# EasyEDA schematic schematic_file_source.json
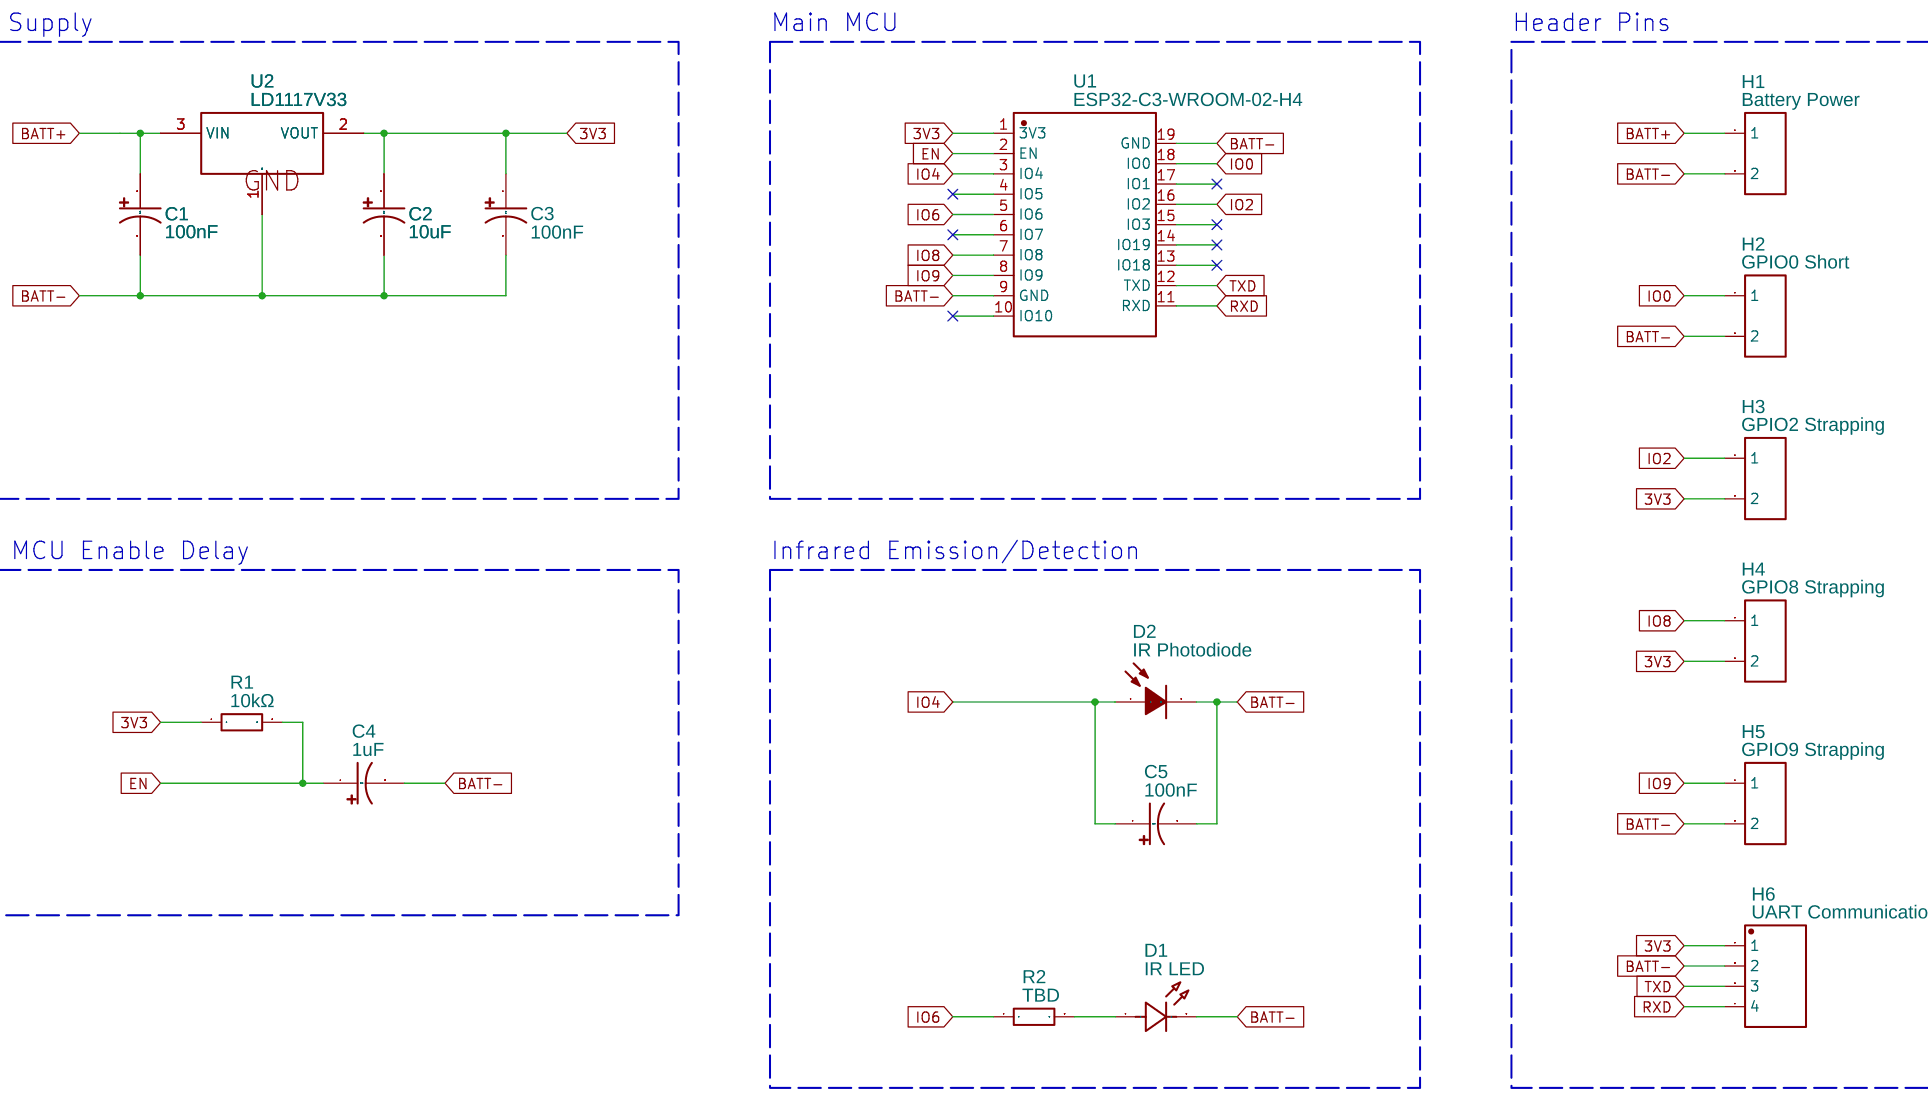
[diagram p0: schematic sheet]

## Parts
C1  100nF  [CAP-TH_BD6.3-P2.50-D1.0-FD]
C2  10uF  [CAP-TH_BD6.3-P2.50-D1.0-FD]
C3  100nF  [CAP-TH_BD6.3-P2.50-D1.0-FD]
C4  1uF  [CAP-TH_BD6.3-P2.50-D1.0-FD]
C5  100nF  [CAP-TH_BD6.3-P2.50-D1.0-FD]
D1  IR LED  [LED-TH_BD5.0-P2.54-FD]
D2  IR Photodiode  [LED-TH_BD6.2-P2.54-RD]
H1  Battery Power  [HDR-TH_2P-P2.54-V-M-1]
H2  GPIO0 Short  [HDR-TH_2P-P2.54-V-M-1]
H3  GPIO2 Strapping  [HDR-TH_2P-P2.54-V-M-1]
H4  GPIO8 Strapping  [HDR-TH_2P-P2.54-V-M-1]
H5  GPIO9 Strapping  [HDR-TH_2P-P2.54-V-M-1]
H6  UART Communication  [HDR-TH_4P-P2.54-V-M]
R1  10kΩ  [RES-TH_BD2.3-L6.5-P10.50-D0.5]
R2  TBD  [RES-TH_BD2.3-L6.5-P10.50-D0.5]
U1  ESP32-C3-WROOM-02-H4  [WIFIM-SMD_18P-L20.0-W18.0-P1.50]
U2  LD1117V33  [TO-220-3_L10.0-W4.5-P2.54-L]

## Library data of the parts
C1 C3-C5 = RK1052GMD122RB: Contributor: LCSC; Supplier: LCSC; Supplier Part: C399034; Manufacturer: Xunda(讯达); JLCPCB Part Class: Extended Part
C2 = RK1052GMD122RB: Contributor: LCSC; Supplier: LCSC; Supplier Part: C399034; Manufacturer: Xunda(讯达); JLCPCB Part Class: Extended Part; Package Display: No
D1 = 15400594F3590: Supplier: LCSC; Supplier Part: C5476599; Manufacturer: Wurth(伍尔特); Contributor: lcsc; JLCPCB Part Class: Extended Part
D2 = MHL590PD03BRT: Contributor: LCSC; Supplier: LCSC; Supplier Part: C405265; Manufacturer: MEIHUA(美华); JLCPCB Part Class: Extended Part
H1-H5 = Header-Male-2.54_1x2: Supplier: LCSC; Manufacturer: TE Connectivity(泰科电子); Manufacturer Part: 826629-2; Supplier Part: C86471; JLCPCB Part Class: Extended Part
H6 = Header-Male-2.54_1x4: Contributor: LCSC; Supplier: LCSC; Manufacturer: Ckmtw(灿科盟); Manufacturer Part: B-2100S04P-A110; Supplier Part: C124378; JLCPCB Part Class: Extended Part
R1 R2 = RI40-1/4W-10KΩ ±5% T: Contributor: LCSC; Supplier: LCSC; Supplier Part: C136549; Manufacturer: CCO(千志电子); JLCPCB Part Class: Extended Part
U1 = ESP32-C3-WROOM-02-H4: Contributor: LCSC; Supplier: LCSC; Supplier Part: C2944070; Manufacturer: ESPRESSIF(乐鑫); JLCPCB Part Class: Extended Part
U2 = LD1117V33: Contributor: LCSC; Supplier: LCSC; Supplier Part: C283467; Manufacturer: ST(意法半导体); JLCPCB Part Class: Extended Part

## Nets
3V3: C2.1 C3.1 H3.2 H4.2 H6.1 R1.1 U1.1(3V3) U2.2(VOUT)
BATT+: C1.1 H1.1 U2.3(VIN)
BATT-: C1.2 C2.2 C3.2 C4.2 C5.2 D1.2(K) D2.2(C) H1.2 H2.2 H5.2 H6.2 U1.9(GND) U1.19(GND) U2.1(GND)
EN: C4.1 R1.2 U1.2(EN)
IO0: H2.1 U1.18(IO0)
IO2: H3.1 U1.16(IO2)
IO4: C5.1 D2.1(A) U1.3(IO4)
IO6: R2.1 U1.5(IO6)
IO8: H4.1 U1.7(IO8)
IO9: H5.1 U1.8(IO9)
RXD: H6.4 U1.11(RXD)
TXD: H6.3 U1.12(TXD)
Net-(D1-1): D1.1(A) R2.2

Not connected (* = marked no-connect by the designer): U1 4(IO5) 6(IO7) 10(IO10) 13(IO18) 14(IO19) 15(IO3) 17(IO1)

## Notes on the sheet
- 1
- 2
- 3
- 4
- 5
- A
- 3.3V Supply
- Main MCU
- Header Pins
- A
- B
- B
- Main MCU Enable Delay
- Infrared Emission/Detection
- C
- C
- D
- D
- *
- Drawn By:
- Elijah Day
- Copyright © 2024 Elijah Day
- Date:
- 2024-07-13
- Sheet:
- 1/1
- Title:
- Rev:
- Wireless Motion Detector Main Board
- A
- 1
- 2
- 3
- 4
- 5
